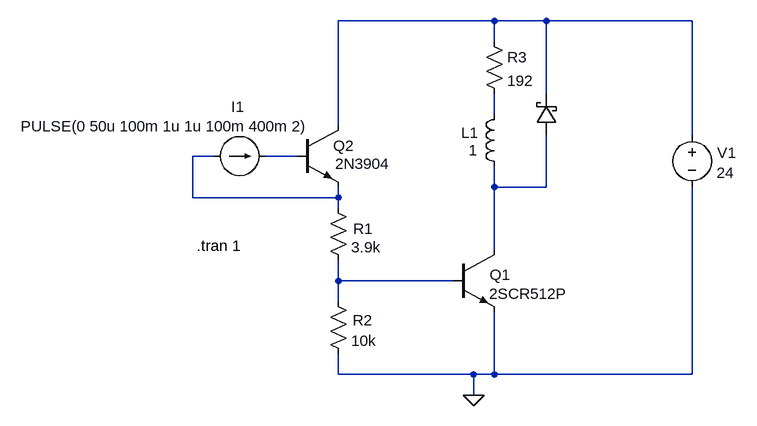
[diagram p0: schematic switch a solenoid.asc]
switch a solenoid.asc, the LTspice schematic file:
Version 4
SHEET 1 880 680
WIRE 144 -48 -96 -48
WIRE 224 -48 144 -48
WIRE 448 -48 224 -48
WIRE 144 -16 144 -48
WIRE 224 64 224 -48
WIRE 144 96 144 64
WIRE -96 112 -96 -48
WIRE 448 128 448 -48
WIRE -288 160 -320 160
WIRE -160 160 -208 160
WIRE 144 208 144 176
WIRE 224 208 224 128
WIRE 224 208 144 208
WIRE -320 224 -320 160
WIRE -96 224 -96 208
WIRE -96 224 -320 224
WIRE -96 240 -96 224
WIRE 144 304 144 208
WIRE -96 352 -96 320
WIRE 80 352 -96 352
WIRE -96 384 -96 352
WIRE -96 496 -96 464
WIRE 112 496 -96 496
WIRE 144 496 144 400
WIRE 144 496 112 496
WIRE 448 496 448 208
WIRE 448 496 144 496
WIRE 112 528 112 496
FLAG 112 528 0
SYMBOL ind 160 192 R180
WINDOW 0 40 68 Left 2
WINDOW 3 42 41 Left 2
SYMATTR InstName L1
SYMATTR Value 1
SYMBOL voltage 448 112 R0
WINDOW 0 39 43 Left 2
WINDOW 3 38 74 Left 2
WINDOW 123 0 0 Left 2
WINDOW 39 0 0 Left 2
SYMATTR InstName V1
SYMATTR Value 24
SYMBOL npn 80 304 R0
WINDOW 0 57 39 Left 2
SYMATTR InstName Q1
SYMATTR Value 2SCR512P
SYMBOL res -112 224 R0
WINDOW 0 39 48 Left 2
SYMATTR InstName R1
SYMATTR Value 3.9k
SYMBOL res -112 368 R0
WINDOW 0 38 45 Left 2
SYMATTR InstName R2
SYMATTR Value 10k
SYMBOL npn -160 112 R0
WINDOW 3 59 60 Left 2
SYMATTR InstName Q2
SYMATTR Value 2N3904
SYMBOL current -288 160 R270
WINDOW 0 60 37 VTop 2
WINDOW 3 61 -74 VBottom 2
WINDOW 123 0 0 Left 2
WINDOW 39 0 0 Left 2
SYMATTR InstName I1
SYMATTR Value PULSE(0 50u 100m 1u 1u 100m 400m 2)
SYMBOL res 128 -32 R0
SYMATTR InstName R3
SYMATTR Value 192
SYMBOL schottky 240 128 R180
WINDOW 0 -35 121 Invisible 2
WINDOW 3 -126 -46 Invisible 2
SYMATTR InstName D2
SYMATTR Value 1N5819
SYMATTR Description Diode
SYMATTR Type diode
TEXT -314 298 Left 2 !.tran 1

The netlist it stands for:
* switch a solenoid.asc
L1 N005 N002 1
V1 N001 0 24
Q1 N005 N006 0 0 2SCR512P
R1 N003 N006 3.9k
R2 N006 0 10k
Q2 N001 N004 N003 0 2N3904
I1 N003 N004 PULSE(0 50u 100m 1u 1u 100m 400m 2)
R3 N001 N002 192
D2 N005 N001 1N5819
.model D D
.lib standard.dio
.model NPN NPN
.model PNP PNP
.lib standard.bjt
.tran 1
.backanno
.end